# Altium schematic sheet SH1 - CONNECTORS.SchDoc: Connectors
size Letter; DrawnBy: Adrianna Ascalon; Organization: UW Robotics; Address1: 200 University Avenue; Address2: Waterloo; Address3: Ontario; Address4: Canada N2L 3G6; SheetNumber: 1; SheetTotal: 3
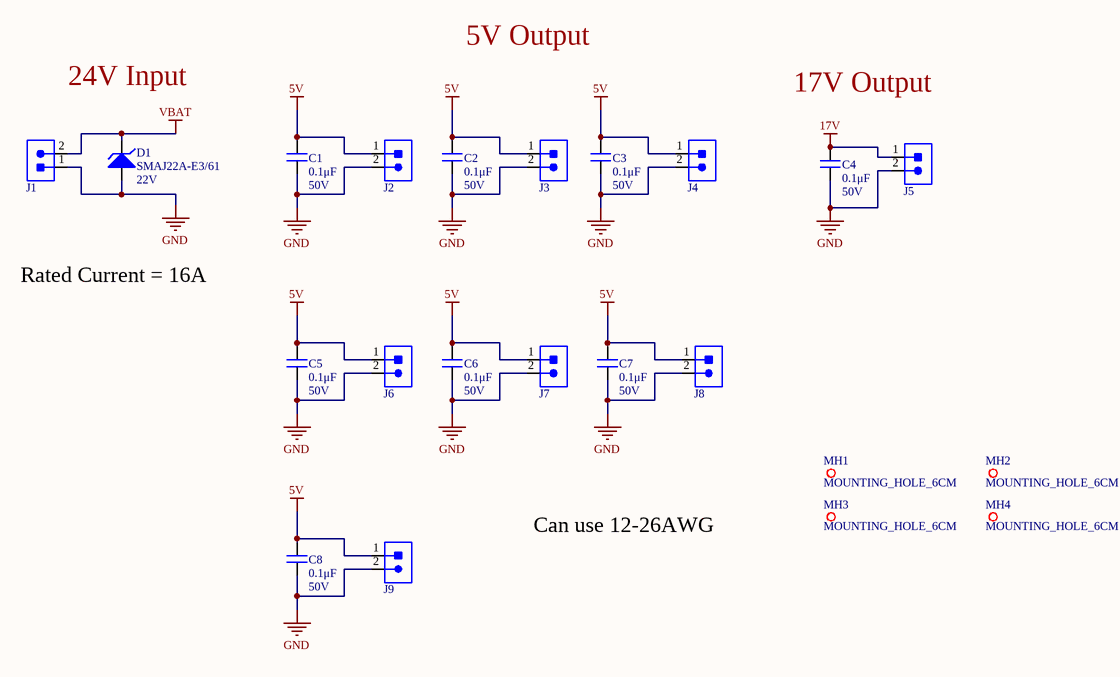
[diagram p0: SH1 - CONNECTORS.SchDoc]

## Parts
C1  0.1μF  Voltage Rating: 50V  [CAPC2012X140N]
C2  0.1μF  Voltage Rating: 50V  [CAPC2012X140N]
C3  0.1μF  Voltage Rating: 50V  [CAPC2012X140N]
C4  0.1μF  Voltage Rating: 50V  [CAPC2012X140N]
C5  0.1μF  Voltage Rating: 50V  [CAPC2012X140N]
C6  0.1μF  Voltage Rating: 50V  [CAPC2012X140N]
C7  0.1μF  Voltage Rating: 50V  [CAPC2012X140N]
C8  0.1μF  Voltage Rating: 50V  [CAPC2012X140N]
D1  Reverse Standoff Voltage: 22V  [DO-214AC_UNI]  (hidden comment: SMAJ22A-E3/61)
J1  1935161  [1935161]  (value not drawn)
J2  1935161  [1935161]  (value not drawn)
J3  1935161  [1935161]  (value not drawn)
J4  1935161  [1935161]  (value not drawn)
J5  1935161  [1935161]  (value not drawn)
J6  1935161  [1935161]  (value not drawn)
J7  1935161  [1935161]  (value not drawn)
J8  1935161  [1935161]  (value not drawn)
J9  1935161  [1935161]  (value not drawn)
MH1  MOUNTING_HOLE_6CM  [MOUNTING_HOLE]
MH2  MOUNTING_HOLE_6CM  [MOUNTING_HOLE]
MH3  MOUNTING_HOLE_6CM  [MOUNTING_HOLE]
MH4  MOUNTING_HOLE_6CM  [MOUNTING_HOLE]

## Nets
5V: C1.2 C2.2 C3.2 C5.2 C6.2 C7.2 C8.2 J2.1 J3.1 J4.1 J6.1 J7.1 J8.1 J9.1
17V: C4.2 J5.1
GND: C1.1 C2.1 C3.1 C4.1 C5.1 C6.1 C7.1 C8.1 D1.1 J1.1 J2.2 J3.2 J4.2 J5.2 J6.2 J7.2 J8.2 J9.2
VBAT: D1.2 J1.2

## Notes on the sheet
- 5V Output
- 24V Input
- 17V Output
- Rated Current = 16A
- Can use 12-26AWG
- Title
- Size:
- Date:
- Letter
- Drawn By:
- Sheet
- of
- File:

## Library data of the parts
C1-C8 = CAP_0.1uF_50V_0805: CAP CER 0.1UF 50V X7R 0805; Manufacturer 1: Murata Electronics; Manufacturer Part Number 1: GCD21BR71H104KA01L; Tolerance: 10%; Mount: Surface Mount; Case Code (Metric): 2012; Case Code (Imperial): 0805; Min Operating Temperature: -55°C; Max Operating Temperature: 125°C; Dielectric: X7R; Termination: SMD/SMT; Length: 2mm; Height: 1.25mm; Width: 0.049inch; Thickness: 0.049inch; Depth: 1.25mm; Ratings: AEC-Q200; Supplier 1: Digi-Key; Supplier Part Number 1: 490-11955-1-ND; Package: 0805 (2012 Metric); Value: 0.1μF
D1 = SMAJ22A-E3/61: TVS DIODE 22V 35.5VC SMA; Manufacturer 1: Vishay Semiconductors; Clamping Voltage: 35.5V; Peak Pulse Power: 400W; Polarity: Unidirectional; Peak Pulse Current: 11.3A; Test Current: 1mA; Breakdown Voltage: 24.4V; Number of Channels: 1; Leakage Current: 1uA; Element Configuration: Single; Max Breakdown Voltage: 26.9V; Max Forward Surge Current (Ifsm): 40A; Working Voltage: 3.5V; Current: 113A; Supplier 1: Digi-Key; Case/Package: SMA; Number of Pins: 2; Min Operating Temperature: -55°C; Max Operating Temperature: 150°C; Max Surge Current: 11.3A; Operating Supply Voltage: 22V; Min Breakdown Voltage: 24.4V; Number of Elements: 1; Reverse Breakdown Voltage: 24.4V; Direction: Unidirectional; Termination: SMD/SMT; Max Reverse Leakage Current: 1uA; Max Power Dissipation: 400W; Voltage Rating (DC): 22V; Power Dissipation: 400W; Voltage: 22V; Length: 0.177inch; Height: 0.09inch; Width: 0.11inch; REACH SVHC: Unknown; Supplier Part Number 1: SMAJ22A-E3/61GICT-ND; Manufacturer Part Number 1: SMAJ22A-E3/61
J1 = CON_2M_TERM: TERM BLK 2POS SIDE ENTRY 5MM; Manufacturer 1: Phoenix Contact; Voltage: 300V; Current: 18A; Connector Type: Screw; Voltage Rating (DC): 320V; Max Current Rating: 16A; Max Supply Voltage: 250V; Current Rating: 17.5A; Number of Poles: 2; Number of Levels: 1; Wire Gauge (Max): 26AWG; Wire Gauge (Min): 12AWG; Approvals: UL; Supplier 1: Digi-Key; Pitch: 5mm; Manufacturer Part Number 1: 1935161; Supplier Part Number 1: 277-1667-ND; Mount: Through Hole; Number of Pins: 2; Weight: 0.067021oz; Contact Material: Copper,Tin; Insulation Material: Nylon; Housing Material: Polyamide; Housing Color: Green; Color: Green; Material: Nylon; Number of Rows: 1; Voltage Rating: 250V; Number of Positions: 2; Number of Positions Per Level: 2; Termination: Solder; Number of Contacts: 2; Number of Circuits: 2; Orientation: Straight; Length: 9mm; Height: 11.3mm; Width: 14.9mm; Depth: 9mm; Wire/Cable Gauge: 26AWG; Flammability Rating: UL94 V-0; REACH SVHC: Unknown
J2-J9 = CON_2M_TERM: TERM BLK 2POS SIDE ENTRY 5MM; Manufacturer 1: Phoenix Contact; Connector Type: Screw; Voltage Rating (DC): 320V; Max Current Rating: 16A; Max Supply Voltage: 250V; Current Rating: 17.5A; Number of Poles: 2; Number of Levels: 1; Current: 18A; Voltage: 300V; Wire Gauge (Max): 26AWG; Wire Gauge (Min): 12AWG; Approvals: UL; Supplier 1: Digi-Key; Mount: Through Hole; Number of Pins: 2; Weight: 0.067021oz; Contact Material: Copper,Tin; Insulation Material: Nylon; Housing Material: Polyamide; Housing Color: Green; Color: Green; Material: Nylon; Number of Rows: 1; Voltage Rating: 250V; Number of Positions: 2; Number of Positions Per Level: 2; Termination: Solder; Number of Contacts: 2; Number of Circuits: 2; Orientation: Straight; Length: 9mm; Height: 11.3mm; Width: 14.9mm; Pitch: 5mm; Depth: 9mm; Wire/Cable Gauge: 26AWG; Flammability Rating: UL94 V-0; REACH SVHC: Unknown; Supplier Part Number 1: 277-1667-ND; Manufacturer Part Number 1: 1935161